# EAGLE design THB6064 (EAGLE 7.6.0)
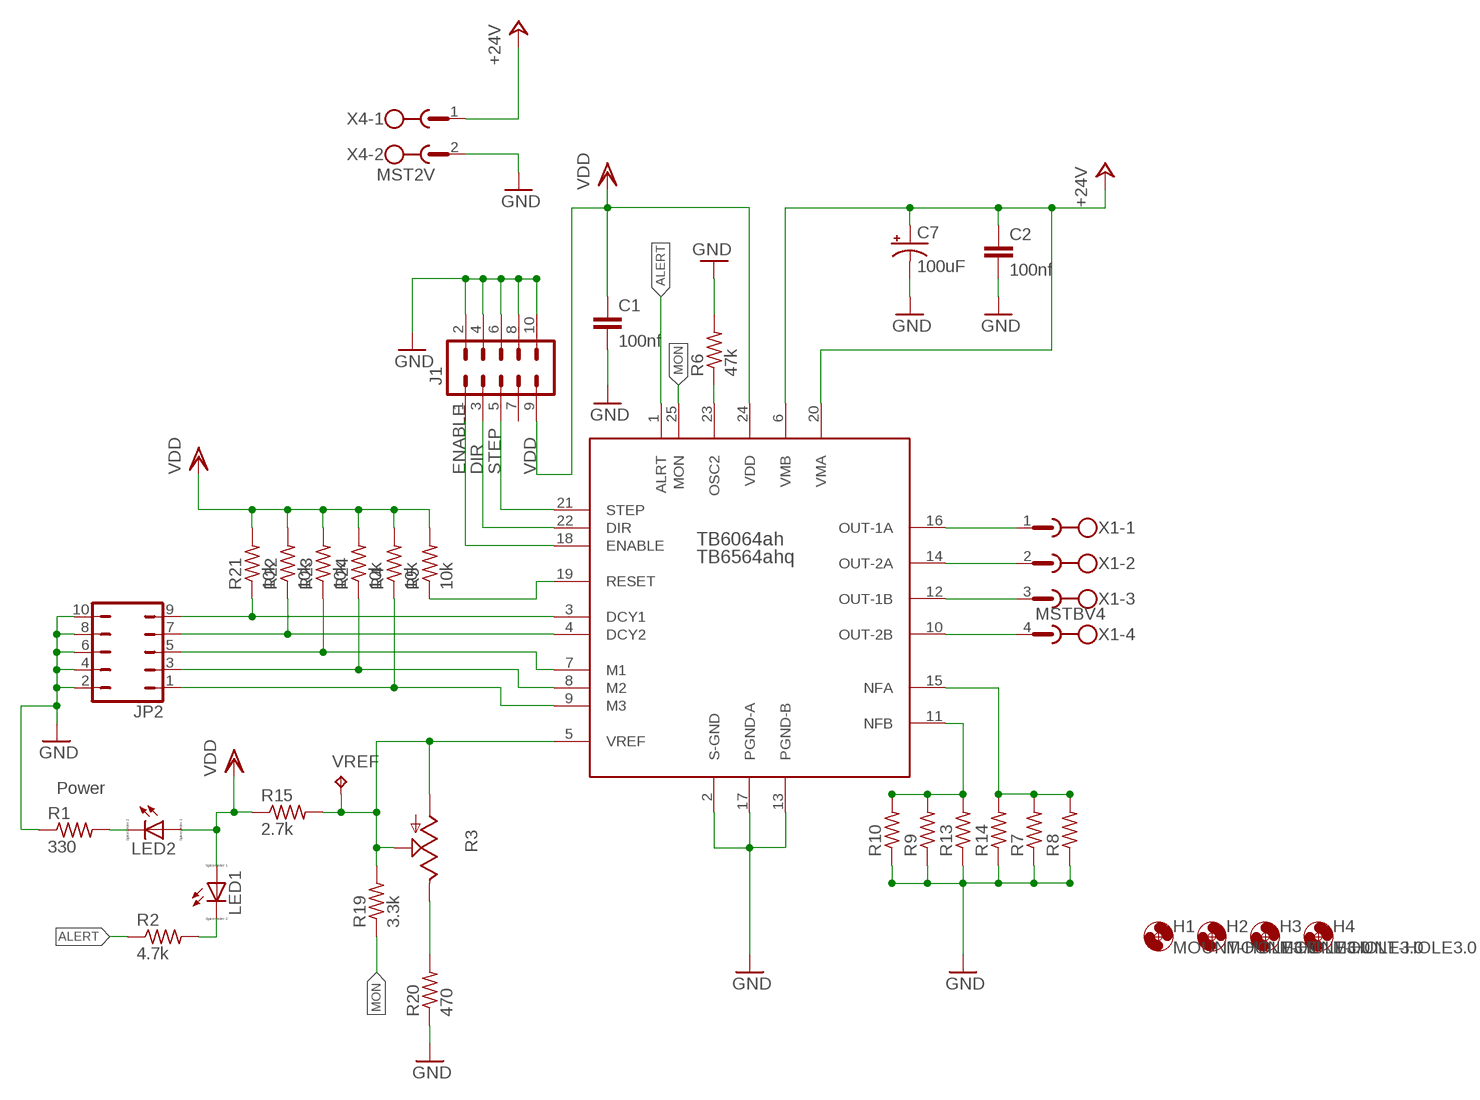
[diagram p0: schematic, sheet 1]

## Parts
C1  100nf  C-EUC1206  [C1206]
C2  100nf  C-EUC1206  [C1206]
C7  100uF  100UF-63V-20%(ELECT)  [NIC_10X10.5_CAP]
H1  MOUNT-HOLE3.0  [3,0]
H2  MOUNT-HOLE3.0  [3,0]
H3  MOUNT-HOLE3.0  [3,0]
H4  MOUNT-HOLE3.0  [3,0]
J1  M05X2SHD  [2X5-SHROUDED]
JP2  JP5Q  [JP5Q]
LED1  LED_E  [LED_1206]
LED2  LED_E  [LED_1206]
R1  330  R-US_R1206  [R1206]
R2  4.7k  R-US_R1206  [R1206]
R3  TRIM_US-CA6V  [CA6V]
R4  10k  R-US_R1206  [R1206]
R5  10k  R-US_R1206  [R1206]
R6  47k  R-US_R1206  [R1206]
R7  R-US_R2512  [R2512]
R8  R-US_R2512  [R2512]
R9  R-US_R2512  [R2512]
R10  R-US_R2512  [R2512]
R13  R-US_R2512  [R2512]
R14  R-US_R2512  [R2512]
R15  2.7k  R-US_R1206  [R1206]
R19  3.3k  R-US_R1206  [R1206]
R20  470  R-US_R1206  [R1206]
R21  10k  R-US_R1206  [R1206]
R22  10k  R-US_R1206  [R1206]
R23  10k  R-US_R1206  [R1206]
R24  10k  R-US_R1206  [R1206]
U$1  THB6064  [ZIP25]
VREF  TPPAD1-17  [P1-17]
X1  MSTBV4  [MSTBV4]
X4  MST2V  [MSTBV2]

## Nets
+24V: C2.1 C7.+ U$1.6(VMB) U$1.20(VMA) X4.1
ALERT: R2.1 U$1.1(ALRT)
DIR: J1.3 U$1.22(DIR)
ENABLE: J1.1 U$1.18(ENABLE)
GND: C1.2 C2.2 C7.- J1.2 J1.4 J1.6 J1.8 J1.10 JP2.2 JP2.4 JP2.6 JP2.8 JP2.10 R1.1 R6.2 R7.1 R8.1 R9.1 R10.1 R13.1 R14.1 R20.1 U$1.2(S-GND) U$1.13(PGND-B) U$1.17(PGND-A) X4.2
MON: R19.1 U$1.25(MON)
N$1: R9.2 R10.2 R13.2 U$1.11(NFB)
N$2: R7.2 R8.2 R14.2 U$1.15(NFA)
N$3: R3.E R20.2
N$4: R5.1 U$1.19(RESET)
N$5: U$1.16(OUT-1A) X1.1
N$6: JP2.9 R21.1 U$1.3(DCY1)
N$7: R6.1 U$1.23(OSC2)
N$8: JP2.7 R22.1 U$1.4(DCY2)
N$9: JP2.5 R23.1 U$1.7(M1)
N$10: JP2.3 R24.1 U$1.8(M2)
N$11: JP2.1 R4.1 U$1.9(M3)
N$12: U$1.14(OUT-2A) X1.2
N$14: U$1.12(OUT-1B) X1.3
N$15: U$1.10(OUT-2B) X1.4
N$16: LED2.C R1.2
N$17: LED1.C R2.2
N$18: R3.A R3.S R15.2 R19.2 U$1.5(VREF) VREF.TP
STEP: J1.5 U$1.21(STEP)
VDD: C1.1 J1.9 LED1.A LED2.A R4.2 R5.2 R15.1 R21.2 R22.2 R23.2 R24.2 U$1.24(VDD)
Unconnected: J1.7

## Notes on the sheet
- Power

## Library data of the parts
C1 C2 = resistor:C-EU: CAPACITOR, European symbol
C7 = SparkFun-Capacitors:100UF-63V-20%(ELECT): CAP-08362 100uF electrolytic SMT 63V 20%; PROD_ID: CAP-08362
H1-H4 = holes:MOUNT-HOLE: MOUNTING HOLE with drill center marker
J1 = SparkFun-Connectors:M05X2: Header 5x2 Standard 10-pin dual row 0.1" header. Commonly used with AVR-ISP. Use with Spark Fun Electronics SKU: PRT-00778
JP2 = jumper:JP5Q: JUMPER
LED1 LED2 = eagle-ltspice:LED_E: LED Source: http://www.osram.convergy.de Source: www.luxeon.com Source: www.kingbright.com; SPICEMODEL: NONE; SPICEPREFIX: D; SPICETYPE: diode
R1 R2 R4-R10 R13-R15 R19-R24 = resistor:R-US_: RESISTOR, American symbol
R3 = pot:TRIM_US-: POTENTIOMETER
U$1 = THB6064:THB6064: Toshiba TB6564AHQ (THB6064AH)
VREF = testpad:TP: Test pad
X1 = con-phoenix-508:MSTBV4: PHOENIX; MPN: MSTBV 2,5/4-GF-5.08; OC_FARNELL: 1792794; OC_NEWARK: 69R9847
X4 = con-phoenix-508:MST2V: PHOENIX; OC_FARNELL: unknown; OC_NEWARK: unknown

## Board
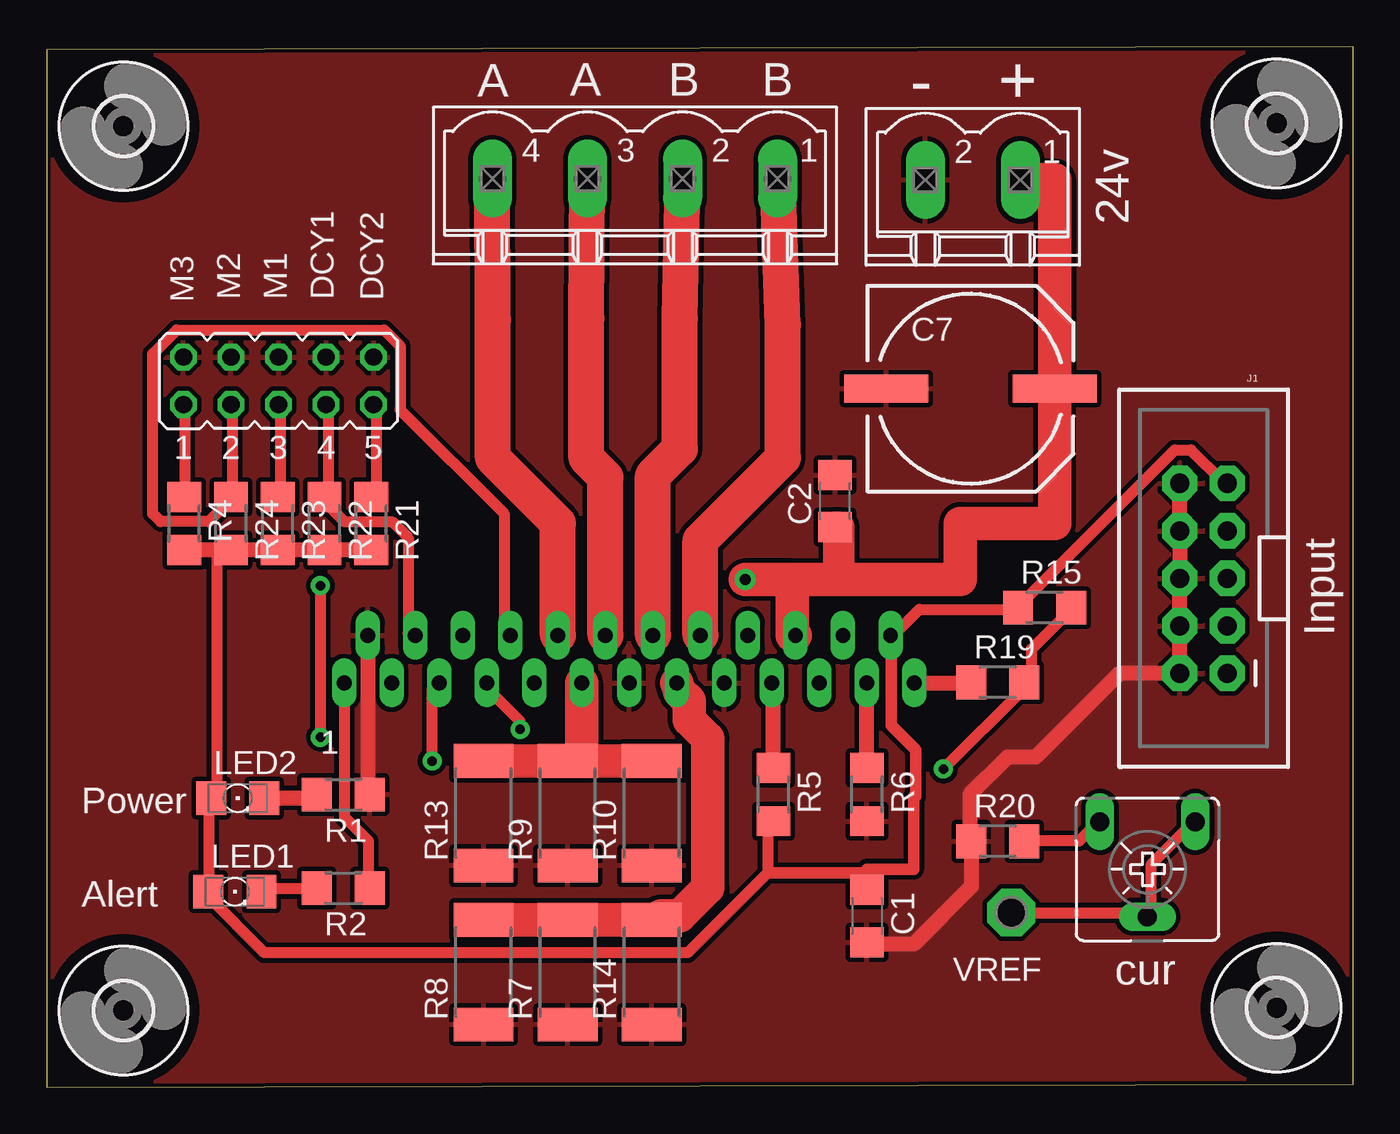
[diagram p1: board, top side]
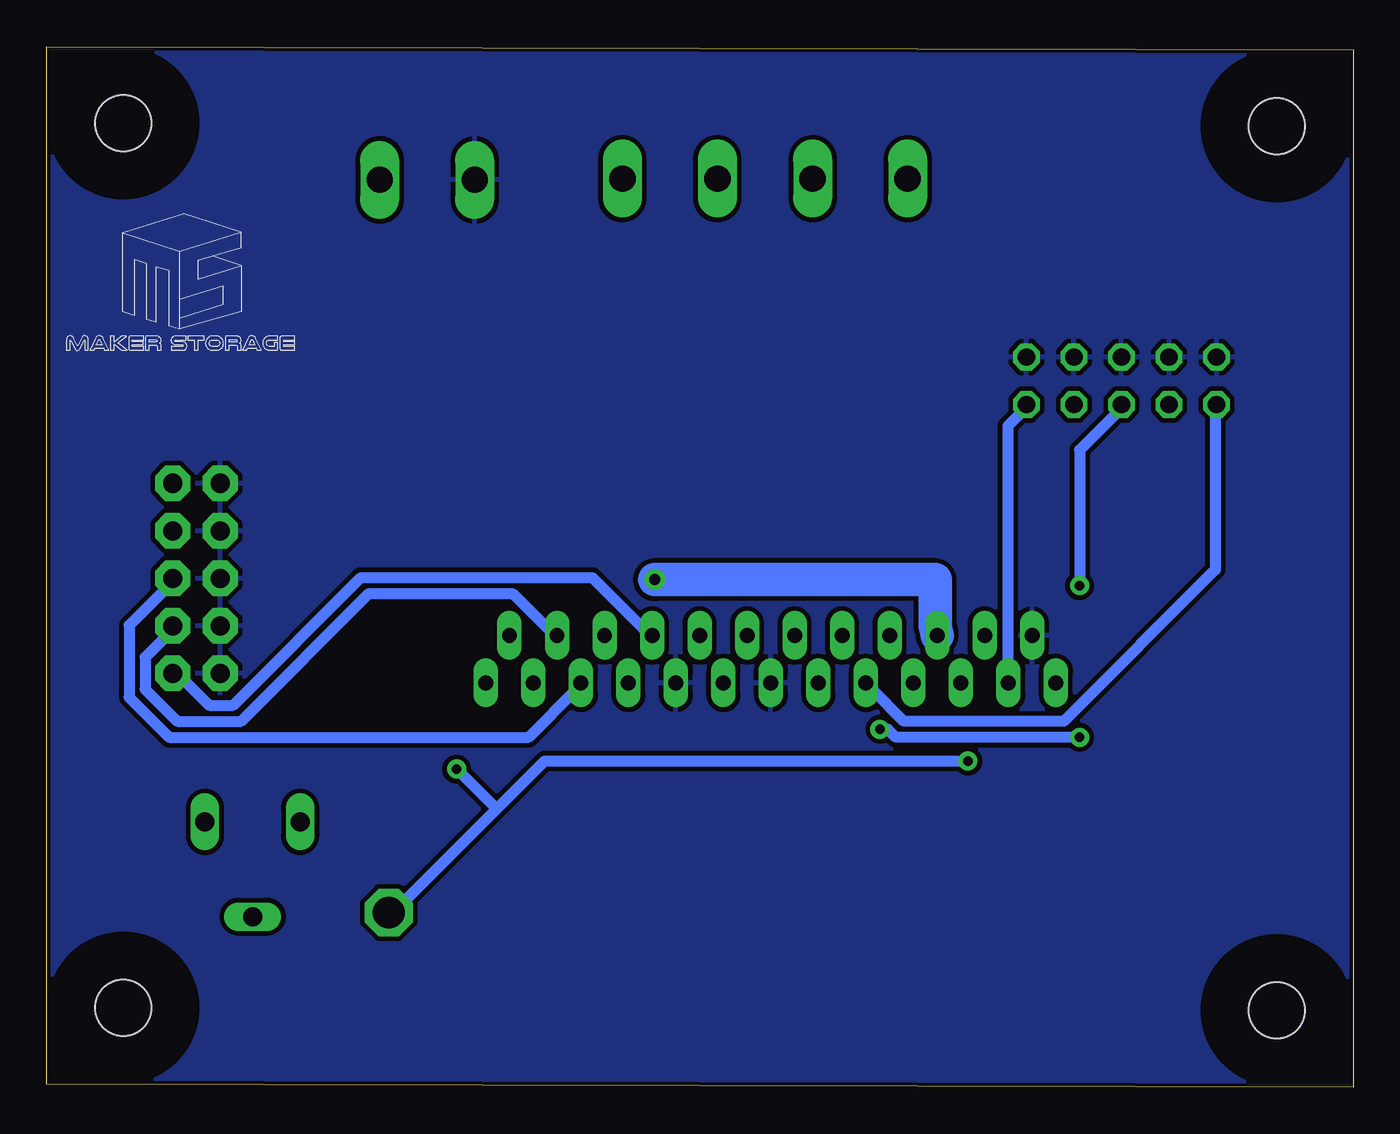
[diagram p2: board, bottom side, seen from below]

Size 69.85 x 55.65 mm. Coordinates in mm from the lower left corner, seen from the top.
Outline: 0,0 69.85,0.15 69.85,55.65 0,55.5 0,0
Copper layers (1*16): Top 0.035mm / dielectric 1.5mm / Bottom 0.035mm
Design rules "SparkFun-2-layer-STANDARD": minimum track width 10mil, minimum drill 20mil, track to track 10mil, track to pad 8mil, pad to pad 8mil, via to via 10mil, smd to smd 8mil, copper to edge 8mil, drill to drill 8mil, minimum pad ring 10mil, minimum via ring 10mil, stop-mask expansion 4mil, vias tented up to drill 25mil, thermal gap 10mil

### Footprints (pad centres in the part's own frame; a part is rotated, then mirrored left to right if it is on the bottom)
C1206 = smd 1.6 x 1.8: 1 -1.4,0; 2 1.4,0
NIC_10X10.5_CAP = smd 4.5 x 1.5: + 4.5,0; - -4.5,0
3,0 = hole 3: 0,0
2X5-SHROUDED = drill 1.016 pad 1.88 octagon: 1 -1.27,5.08; 2 1.27,5.08; 3 -1.27,2.54; 4 1.27,2.54; 5 -1.27,0; 6 1.27,0; 7 -1.27,-2.54; 8 1.27,-2.54; 9 -1.27,-5.08; 10 1.27,-5.08
JP5Q = drill 0.914 octagon: 1 -5.08,-1.27; 2 -5.08,1.27; 3 -2.54,-1.27; 4 -2.54,1.27; 5 0,-1.27; 6 0,1.27; 7 2.54,-1.27; 8 2.54,1.27; 9 5.08,-1.27; 10 5.08,1.27
LED_1206 = smd 1.6 x 1.803: A -1.422,0; C 1.422,0
R1206 = smd 1.6 x 1.803: 1 -1.422,0; 2 1.422,0
CA6V = drill 1.016 long: A -2.54,-2.54; E 2.54,-2.54; S 0,2.54
R2512 = smd 1.8 x 3.2: 1 -2.8,0; 2 2.8,0
ZIP25 = drill 0.8 long: 1 -13.97,0; 2 -12.7,2.54; 3 -11.43,0; 4 -10.16,2.54; 5 -8.89,0; 6 -7.62,2.54; 7 -6.35,0; 8 -5.08,2.54; 9 -3.81,0; 10 -2.54,2.54; 11 -1.27,0; 12 0,2.54; 13 1.27,0; 14 2.54,2.54; 15 3.81,0; 16 5.08,2.54; 17 6.35,0; 18 7.62,2.54; 19 8.89,0; 20 10.16,2.54; 21 11.43,0; 22 12.7,2.54; 23 13.97,0; 24 15.24,2.54; 25 16.51,0
P1-17 = drill 1.702 pad 2.54 octagon: TP 0,0
MSTBV4 = drill 1.397 long: 1 -7.62,0; 2 -2.54,0; 3 2.54,0; 4 7.62,0
MSTBV2 = drill 1.397 long: 1 -2.54,0; 2 2.54,0

### Placement (x,y rotation side)
C1  43.85,9.15 270 top
C2  42.15,31.35 90 top
C7  49.39,37.37 0 top
H1  65.75,51.55 0 top
H2  65.75,4.25 0 top
H3  4.1,4.1 0 top
H4  4.1,51.4 0 top
J1  61.85,27.22 180 top
JP2  12.39,37.78 0 top
LED1  10.06,10.46 0 top
LED2  10.21,15.46 0 top
R1  15.85,15.65 180 top
R2  15.85,10.65 180 top
R3  58.85,11.65 180 top
R4  7.35,30.15 270 top
R5  38.85,15.65 270 top
R6  43.85,15.65 270 top
R7  27.85,6.15 90 top
R8  23.35,6.15 90 top
R9  27.85,14.65 90 top
R10  32.35,14.65 90 top
R13  23.35,14.65 90 top
R14  32.35,6.15 90 top
R15  53.35,25.65 0 top
R19  50.85,21.65 0 top
R20  50.85,13.15 0 top
R21  17.35,30.15 270 top
R22  14.85,30.15 270 top
R23  12.35,30.15 270 top
R24  9.85,30.15 270 top
U$1  29.87,21.63 0 top
VREF  51.56,9.34 180 top
X1  31.45,48.6 180 top
X4  49.51,48.53 180 top

### Tracks (layer width: path | path; a pad name or v marks a point on that pad's centre or on a via)
+24V  (via drill 0.6)
  Top 0.6: 41.1,27.69 41.1,27.15
  Top 1.676: C2.1 42.35,29.95 42.35,27.15
  Top 1.778: X4.1 53.89,48.53 C7.+ 53.89,30.15 48.85,30.15 48.85,27.15 42.35,27.15 41.1,27.15 39.85,27.15 | U$1.20 39.85,24.17 39.85,27.15 | 39.85,27.15 v37.35,27.15
  Bottom 1.778: v37.35,27.15 22.35,27.15 22.35,24.65 U$1.6
ALERT
  Top 0.6: R2.1 17.19,11.03 17.19,13.17 15.91,14.45 15.91,21.28 U$1.1
DIR
  Bottom 0.6: U$1.22 42.81,24.27 44.94,26.4 52.63,26.4 59.46,19.57 62.88,19.57 64.59,21.28 64.59,22.99 63.3,24.27 J1.3
ENABLE
  Bottom 0.6: U$1.18 37.69,24.27 40.67,27.26 53.06,27.26 59.89,20.43 61.17,20.43 62.88,22.13 J1.1
GND
  Top 0.813: J1.10 J1.8 J1.6 J1.4 J1.2 57.34,22.14 52.85,17.65 51.35,17.65 49.35,15.65 49.35,13.23 R20.1 49.43,10.73 46.35,7.65 43.95,7.65 C1.2 | U$1.2 17.17,15.75 R1.1
  pour Bottom: -23.65,-0.85 72.85,-1.85 73.35,63.15 -23.15,64.15
  pour Top: -36.65,-5.35 76.35,-4.35 76.85,66.65 -36.15,65.65
MON
  Top 0.813: U$1.25 49.41,21.63 R19.1
N$1
  Top 0.813: 28.6,17.45 R9.2
  Top 1.778: U$1.11 28.6,17.45 R10.2 | R13.2 R9.2
N$2
  Top 1.778: R8.2 R7.2 R14.2 32.85,9.15 33.85,9.15 35.35,10.65 35.35,18.65 34.35,19.65 34.35,20.65 33.85,21.15 U$1.15
N$3
  Top 0.6: R20.2 52.63,13.17 55.19,13.17 56.05,14.02 R3.E
  Top 0.813: R20.2 51.85,13.15
N$4
  Top 0.813: R5.1 38.85,21.54 U$1.19
N$5
  Top 1.93: U$1.16 34.95,29.25 39.35,33.65 39.35,40.77 X1.1
N$6
  Top 0.6: R21.1 17.62,31.96 17.62,36.23 JP2.9
  Bottom 0.6: U$1.3 18.47,21.71 18.47,35.37 17.62,36.23 JP2.9
N$7
  Top 0.813: R6.1 U$1.23
N$8
  Top 0.6: JP2.7 15.05,36.23 15.05,31.96 R22.1 14.63,31.53 15.91,30.25 18.47,30.25 19.32,29.39 19.32,24.27 U$1.4
N$9  (via drill 0.51)
  Top 0.6: R23.1 12.49,31.96 12.49,36.23 JP2.5 | v25.3,19.15 25.3,19.57 23.59,21.28 U$1.7 | v14.63,26.83 v14.63,18.72
  Bottom 0.6: v25.3,19.15 24.88,19.15 24.45,18.72 v14.63,18.72 | v14.63,26.83 14.63,34.09 12.49,36.23 JP2.5
N$10
  Top 0.6: JP2.3 9.93,36.23 9.93,31.96 R24.1 9.93,31.53 8.65,30.25 6.09,30.25 5.66,30.67 5.66,39.21 6.94,40.5 18.04,40.5 18.9,39.64 18.9,36.23 24.45,30.67 24.45,24.27 U$1.8
N$11
  Top 0.6: R4.1 7.37,31.96 7.37,36.23 JP2.1
  Bottom 0.6: U$1.9 25.73,21.28 24.02,19.57 15.48,19.57 7.37,27.69 7.37,36.23 JP2.1
N$12
  Top 1.93: U$1.14 32.41,32.71 33.85,34.15 33.85,41.11 X1.2
N$14
  Top 1.93: U$1.12 29.87,32.63 28.85,33.65 28.85,41.11 X1.3
N$15
  Top 1.93: U$1.10 27.33,30.17 23.85,33.65 23.85,41.03 X1.4
N$16
  Top 0.813: LED2.C 14.24,15.46 R1.2
N$17
  Top 0.6: LED1.C 11.64,10.61 14.2,10.61 R2.2
N$18  (via drill 0.51)
  Top 0.6: R3.A 61.17,14.02 59.04,11.89 59.04,9.33 R3.S 58.61,9.33 51.78,9.33 VREF.TP | R15.2 54.77,25.55 52.63,23.42 52.63,21.71 R19.2 52.2,21.28 v47.93,17.01 | v20.6,17.44 20.6,21.28 U$1.5
  Bottom 0.6: v20.6,17.44 43.24,17.44 45.8,14.88 | 45.8,14.88 51.35,9.33 VREF.TP | 45.8,14.88 v47.93,17.01
STEP
  Bottom 0.6: U$1.21 41.53,21.28 44.09,18.72 63.3,18.72 65.44,20.85 65.44,24.7 63.3,26.83 J1.5
VDD
  Top 0.6: R24.2 9.08,28.54 9.08,15.73 LED2.A 8.65,15.3 8.65,10.61 LED1.A 8.65,10.18 11.64,7.19 34.27,7.19 38.54,11.46 38.54,14.02 R5.2 | U$1.24 45.37,24.27 46.65,25.55 51.78,25.55 R15.1 52.2,25.98 60.32,34.09 61.17,34.09 62.88,32.38 J1.9
  Top 0.61: 45.15,24.13 45.15,19.35 46.45,18.05 46.45,15.55 46.35,15.55 46.35,11.65 43.85,11.65 43.85,11.46 | 38.54,11.46 43.85,11.46 | 43.85,11.46 43.85,11.15 C1.1
  Top 0.813: 8.64,15.31 LED2.A | 45.15,24.13 U$1.24 | R21.2 R22.2 R23.2 R24.2 R4.2

### Text on the board
tPlace: A | A | B | B | - | + | 24v | M2 | M1 | DCY1 | M3 | DCY2 | Input | Power | Alert | cur